# EAGLE design AD7173 (EAGLE 7.4.0)
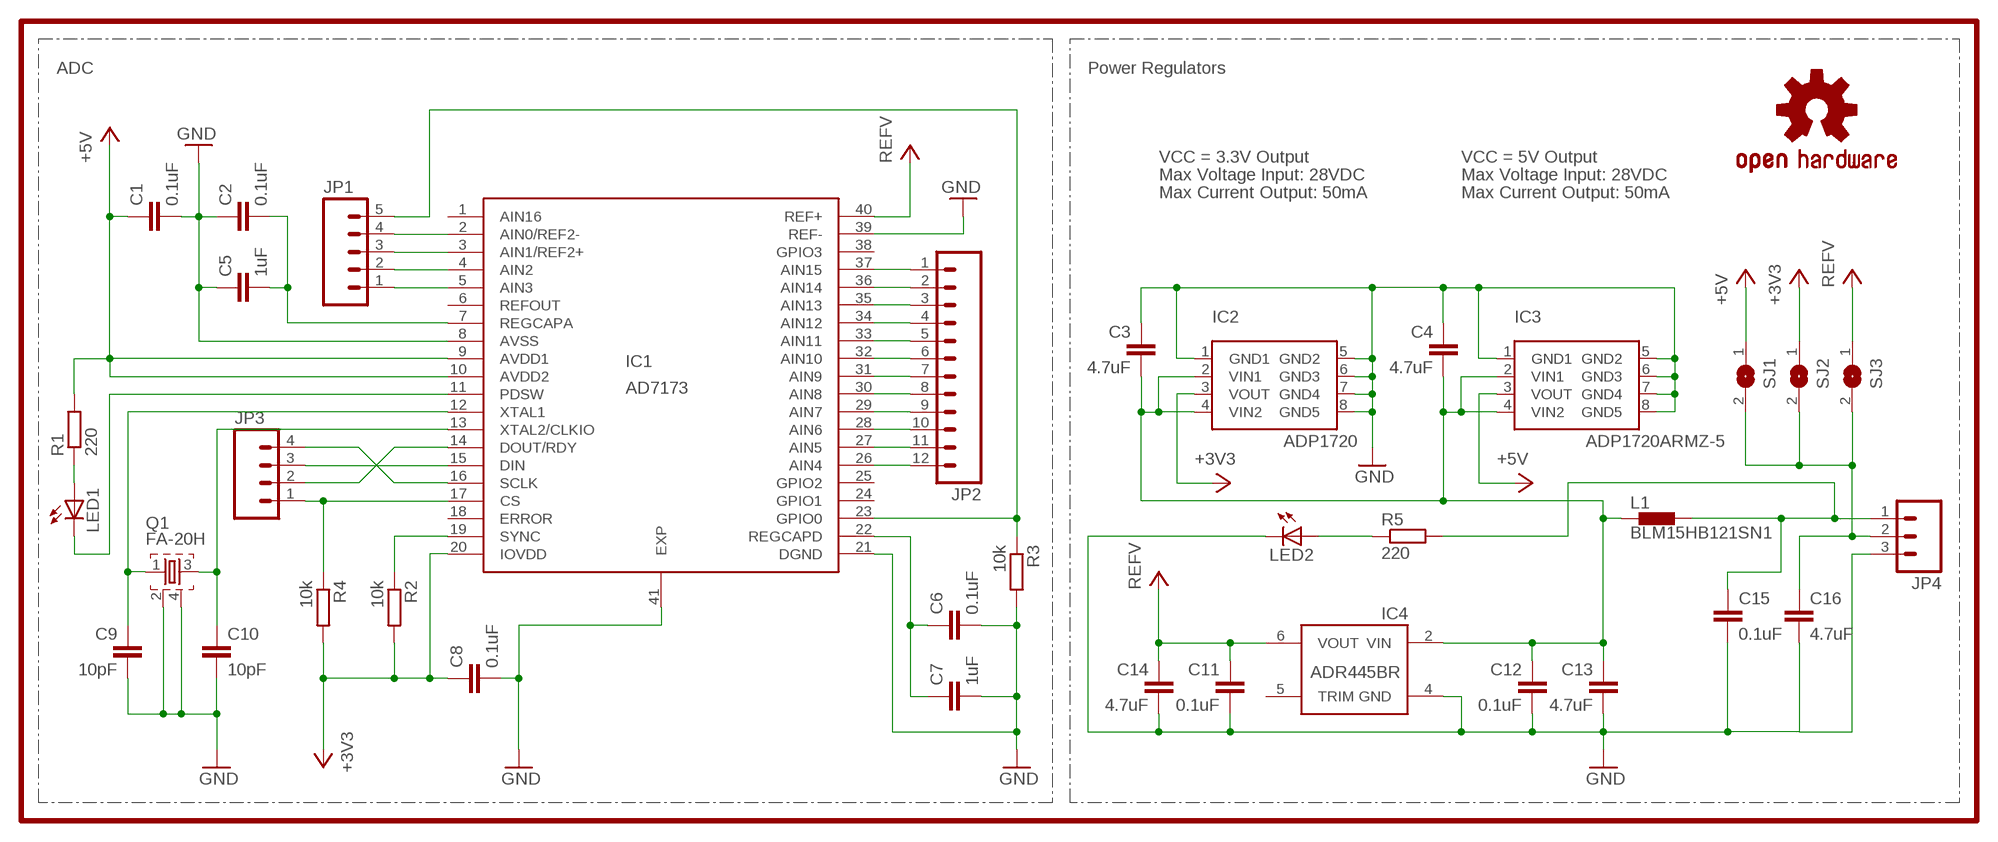
[diagram p0: schematic, sheet 1]

## Parts
C1  0.1uF  C-EUC0402  [C0402]
C2  0.1uF  C-EUC0402  [C0402]
C3  4.7uF  C-EUC0402  [C0402]
C4  4.7uF  C-EUC0402  [C0402]
C5  1uF  C-EUC0402  [C0402]
C6  0.1uF  C-EUC0402  [C0402]
C7  1uF  C-EUC0402  [C0402]
C8  0.1uF  C-EUC0402  [C0402]
C9  10pF  C-EUC0402  [C0402]
C10  10pF  C-EUC0402  [C0402]
C11  0.1uF  C-EUC0402  [C0402]
C12  0.1uF  C-EUC0402  [C0402]
C13  4.7uF  C-EUC0402  [C0402]
C14  4.7uF  C-EUC0402  [C0402]
C15  0.1uF  C-EUC0402  [C0402]
C16  4.7uF  C-EUC0402  [C0402]
IC1  AD7173  [LFCSP_WQ6X6MM]
IC2  ADP1720  POWER  [MSOP08]
IC3  ADP1720ARMZ-5  POWER  [MSOP08]
IC4  ADR445BR  [SO8]
JP1  M05PTH  [1X05]
JP2  M12PTH  [1X12]
JP3  M04PTH  [1X04]
JP4  M03PTH  [1X03]
L1  BLM15HB121SN1  [0402]
LED1  LEDCHIP-LED0603  [CHIP-LED0603]
LED2  LEDCHIP-LED0603  [CHIP-LED0603]
LOGO1  OSHW-LOGOS  [OSHW-LOGO-S]
Q1  FA-20H  [FA-20H]
R1  220  R-EU_R0402  [R0402]
R2  10k  R-EU_R0402  [R0402]
R3  10k  R-EU_R0402  [R0402]
R4  10k  R-EU_R0402  [R0402]
R5  220  R-EU_R0402  [R0402]
SJ1  SJ  [SJ]
SJ2  SJ  [SJ]
SJ3  SJ  [SJ]

## Nets
+3V3: C8.1 IC1.20(IOVDD) IC2.3(VOUT) R2.2 R4.2 SJ2.1
+5V: C1.1 IC1.9(AVDD1) IC1.10(AVDD2) IC3.3(VOUT) R1.2 SJ1.1
GND: C1.2 C2.1 C3.1 C4.1 C5.1 C6.2 C7.2 C8.2 C9.2 C10.2 C11.2 C12.2 C13.2 C14.2 C15.2 C16.2 IC1.8(AVSS) IC1.21(DGND) IC1.39(REF-) IC1.41(EXP) IC2.1(GND1) IC2.5(GND2) IC2.6(GND3) IC2.7(GND4) IC2.8(GND5) IC3.1(GND1) IC3.5(GND2) IC3.6(GND3) IC3.7(GND4) IC3.8(GND5) IC4.4(GND) JP4.3 LED2.C Q1.2 Q1.4 R3.2
N$1: LED1.A R1.1
N$3: IC1.17(CS) JP3.1 R4.1
N$4: IC1.37(AIN15) JP2.1
N$5: IC1.23(GPIO0) JP1.5 R3.1
N$6: C2.2 C5.2 IC1.7(REGCAPA)
N$7: IC1.36(AIN14) JP2.2
N$8: IC1.35(AIN13) JP2.3
N$9: IC1.34(AIN12) JP2.4
N$10: IC1.33(AIN11) JP2.5
N$11: IC1.32(AIN10) JP2.6
N$12: IC1.31(AIN9) JP2.7
N$13: IC1.30(AIN8) JP2.8
N$14: IC1.29(AIN7) JP2.9
N$15: IC1.28(AIN6) JP2.10
N$16: IC1.27(AIN5) JP2.11
N$17: IC1.26(AIN4) JP2.12
N$18: IC1.5(AIN3) JP1.1
N$19: IC1.4(AIN2) JP1.2
N$20: IC1.3(AIN1/REF2+) JP1.3
N$21: IC1.2(AIN0/REF2-) JP1.4
N$22: C10.1 IC1.13(XTAL2/CLKIO) Q1.3
N$23: IC1.14(DOUT/RDY) JP3.2
N$24: IC1.15(DIN) JP3.3
N$25: IC1.16(SCLK) JP3.4
N$27: C9.1 IC1.12(XTAL1) Q1.1
N$28: C16.1 JP4.2 SJ1.2 SJ2.2 SJ3.2
N$30: C15.1 JP4.1 L1.2 R5.2
N$31: LED2.A R5.1
N$38: C6.1 C7.1 IC1.22(REGCAPD)
N$39: IC1.19(SYNC) R2.1
SPI: IC1.11(PDSW) LED1.C
VCC: C11.1 C14.1 IC1.40(REF+) IC4.6(VOUT) SJ3.1 ; supply symbol labelled REFV
VIN: C3.2 C4.2 C12.1 C13.1 IC2.2(VIN1) IC2.4(VIN2) IC3.2(VIN1) IC3.4(VIN2) IC4.2(VIN) L1.1
Unconnected: IC1.1(AIN16) IC1.6(REFOUT) IC1.18(ERROR) IC1.24(GPIO1) IC1.25(GPIO2) IC1.38(GPIO3) IC4.5(TRIM)

## Notes on the sheet
- ADC | Power Regulators
- VCC = 3.3V Output | VCC = 5V Output
- Max Voltage Input: 28VDC | Max Voltage Input: 28VDC
- Max Current Output: 50mA | Max Current Output: 50mA

## Library data of the parts
C1-C16 = rcl:C-EU: CAPACITOR, European symbol
IC1 = AD7173:AD7173: IEEE 802.15.4? 2.4 GHz RF Transceiver Source: http://ww1.microchip.com/downloads/en/DeviceDoc/39776a.pdf; MPN: MRF24J40-I/ML; OC_FARNELL: 1436019; OC_NEWARK: 17M0699
IC2 IC3 = AD7173:POWER
IC4 = kblom:ADR44: Ultralow Noise, LDO XFET Voltage References with Current Sink and Source Applications: Precision data acquisition systems High resolution data converters Battery-powered instrumentation Portable medical instruments Industrial process control systems Precision instruments Optical control circuits source <http://www.analog.com/static/imported-files/data_sheets/ADR440_441_443_444_445.pdf> vref
JP1 = SparkFun-Connectors:M05: Header 5 Standard 5-pin 0.1" header. Use with straight break away headers (SKU : PRT-00116), right angle break away headers (PRT-00553), swiss pins (PRT-00743), machine pins (PRT-00117), and female headers (PRT-00115). Molex polarized connector foot print use with SKU : PRT-08230 with associated crimp pins and housings.
JP2 = SparkFun-Connectors:M12: Header 12 Standard 12-pin 0.1" header. Use with straight break away headers (SKU : PRT-00116), right angle break away headers (PRT-00553), swiss pins (PRT-00743), machine pins (PRT-00117), and female headers (PRT-00115).
JP3 = SparkFun-Connectors:M04: Header 4 Standard 4-pin 0.1" header. Use with straight break away headers (SKU : PRT-00116), right angle break away headers (PRT-00553), swiss pins (PRT-00743), machine pins (PRT-00117), and female headers (PRT-00115). Molex polarized connector foot print use with SKU : PRT-08231 with associated crimp pins and housings. 1MM SMD Version SKU: PRT-10208
JP4 = SparkFun-Connectors:M03: Header 3 Standard 3-pin 0.1" header. Use with straight break away headers (SKU : PRT-00116), right angle break away headers (PRT-00553), swiss pins (PRT-00743), machine pins (PRT-00117), and female headers (PRT-00115). Molex polarized connector foot print use with SKU : PRT-08232 with associated crimp pins and housings.
L1 = inductors:BLM15H: EMIFIL (R) Chip Ferrite Bead for GHz Noise Source: http://www.murata.com/ Ferrite Bead BLM15H.pdf
LED1 LED2 = led:LED: LED OSRAM: - CHIPLED LG R971, LG N971, LY N971, LG Q971, LY Q971, LO R971, LY R971 LH N974, LH R974 LS Q976, LO Q976, LY Q976 LO Q996 - Hyper CHIPLED LW Q18S LB Q993, LB Q99A, LB R99A - SideLED LS A670, LO A670, LY A670, LG A670, LP A670 LB A673, LV A673, LT A673, LW A673 LH A674 LY A675 LS A676, LA A676, LO A676, LY A676, LW A676 LS A679, LY A679, LG A679 - Hyper Micro SIDELED® LS Y876, LA Y876, LO Y876, LY Y876 LT Y87S - SmartLED LW L88C, LW L88S LB L89C, LB L89S, LG L890 LS L89K, LO L89K, LY L89K LS L896, LA L896, LO L896, LY L896 - TOPLED LS T670, LO T670, LY T670, LG T670, LP T670 LSG T670, LSP T670, LSY T670, LOP T670, LYG T670 LG T671, LOG T671, LSG T671 LB T673, LV T673, LT T673, LW T673 LH T674 LS T676, LA T676, LO T676, LY T676, LB T676, LH T676, LSB T676, LW T676 LB T67C, LV T67C, LT T67C, LS T67K, LO T67K, LY T67K, LW E67C LS E67B, LA E67B, LO E67B, LY E67B, LB E67C, LV E67C, LT E67C LW T67C LS T679, LY T679, LG T679 LS T770, LO T770, LY T770, LG T770, LP T770 LB T773, LV T773, LT T773, LW T773 LH T774 LS E675, LA E675, LY E675, LS T675 LS T776, LA T776, LO T776, LY T776, LB T776 LHGB T686 LT T68C, LB T68C - Hyper Mini TOPLED® LB M676 - Mini TOPLED Santana® LG M470 LS M47K, LO M47K, LY M47K Source: http://www.osram.convergy.de LUXEON: - LUMILED® LXK2-PW12-R00, LXK2-PW12-S00, LXK2-PW14-U00, LXK2-PW14-V00 LXK2-PM12-R00, LXK2-PM12-S00, LXK2-PM14-U00 LXK2-PE12-Q00, LXK2-PE12-R00, LXK2-PE12-S00, LXK2-PE14-T00, LXK2-PE14-U00 LXK2-PB12-K00, LXK2-PB12-L00, LXK2-PB12-M00, LXK2-PB14-N00, LXK2-PB14-P00, LXK2-PB14-Q00 LXK2-PR12-L00, LXK2-PR12-M00, LXK2-PR14-Q00, LXK2-PR14-R00 LXK2-PD12-Q00, LXK2-PD12-R00, LXK2-PD12-S00 LXK2-PH12-R00, LXK2-PH12-S00 LXK2-PL12-P00, LXK2-PL12-Q00, LXK2-PL12-R00 Source: www.luxeon.com KINGBRIGHT: KA-3528ASYC Source: www.kingbright.com
LOGO1 = SparkFun-Aesthetics:OSHW-LOGO: Open Source Hardware Logo This logo indicates the piece of hardware it is found on incorporates a OSHW license and/or adheres to the definition of open source hardware found here: http://freedomdefined.org/OSHW
Q1 = crystal:FA-: MHz RANGE CRYSTAL UNIT Source: Epson Toyocom
R1-R5 = rcl:R-EU_: RESISTOR, European symbol
SJ1-SJ3 = jumper:SJ: SMD solder JUMPER

## Net classes
0 default: clearance 0.205 mm

## Board
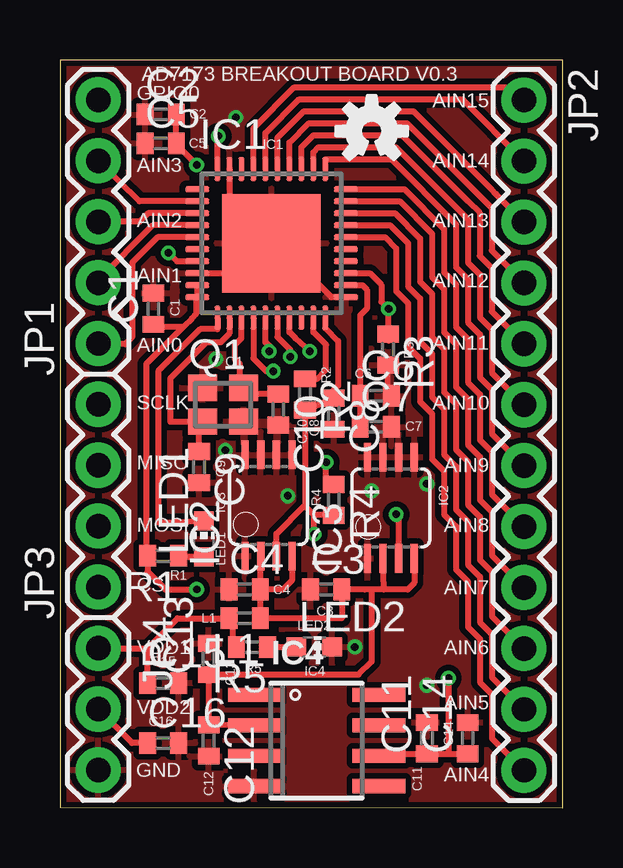
[diagram p1: board, top side]
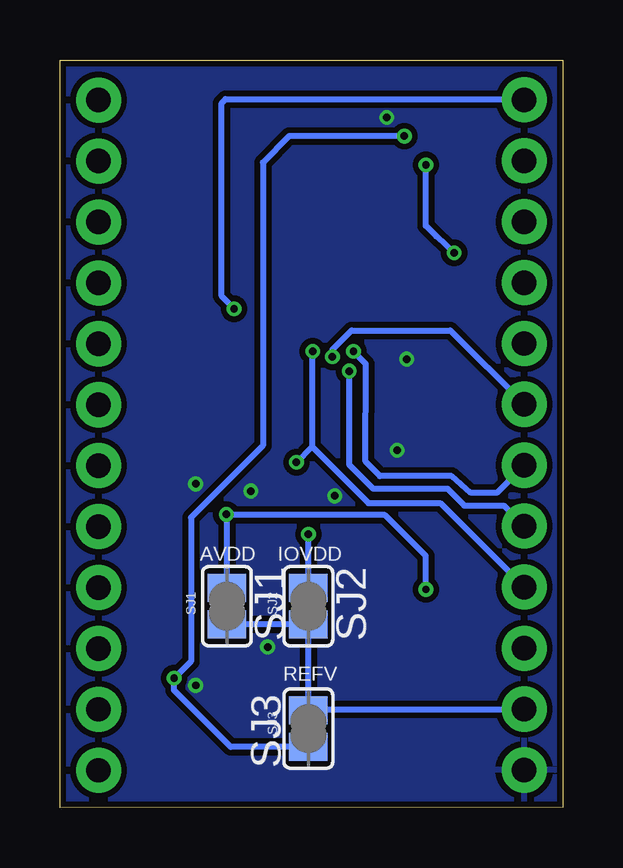
[diagram p2: board, bottom side, seen from below]

Size 20.96 x 31.17 mm. Coordinates in mm from the lower left corner, seen from the top.
Outline: 0,0.01 20.96,0 20.96,31.17 0,31.17 0,0.01
Copper layers (1*16): Top 0.035mm / dielectric 1.5mm / Bottom 0.035mm
Design rules "dirt_cheap_dirty_boards.v1": minimum track width 5mil, minimum drill 12mil, track to track 5mil, track to pad 5mil, pad to pad 5mil, via to via 5mil, smd to smd 0mil, copper to edge 10mil, drill to drill 10mil, minimum pad ring 10mil, minimum via ring 6mil, stop-mask expansion 2mil, vias tented up to drill 25mil, thermal gap 10mil

### Footprints (pad centres in the part's own frame; a part is rotated, then mirrored left to right if it is on the bottom)
C0402 = smd 0.7 x 0.9: 1 -0.65,0; 2 0.65,0
LFCSP_WQ6X6MM = smd 1 x 0.25: 1 -3.1,2.25; 2 -3.1,1.75; 3 -3.1,1.25; 4 -3.1,0.75; 5 -3.1,0.25; 6 -3.1,-0.25; 7 -3.1,-0.75; 8 -3.1,-1.25; 9 -3.1,-1.75; 10 -3.1,-2.25; 21 3.1,-2.25; 22 3.1,-1.75; 23 3.1,-1.25; 24 3.1,-0.75; 25 3.1,-0.25; 26 3.1,0.25; 27 3.1,0.75; 28 3.1,1.25; 29 3.1,1.75; 30 3.1,2.25 | smd 0.25 x 1: 11 -2.25,-3.1; 12 -1.75,-3.1; 13 -1.25,-3.1; 14 -0.75,-3.1; 15 -0.25,-3.1; 16 0.25,-3.1; 17 0.75,-3.1; 18 1.25,-3.1; 19 1.75,-3.1; 20 2.25,-3.1; 31 2.25,3.1; 32 1.75,3.1; 33 1.25,3.1; 34 0.75,3.1; 35 0.25,3.1; 36 -0.25,3.1; 37 -0.75,3.1; 38 -1.25,3.1; 39 -1.75,3.1; 40 -2.25,3.1 | smd 4.1 x 4.1: 41 0,0
MSOP08 = smd 0.3 x 1.2: 1 -0.976,-2.113; 2 -0.326,-2.113; 3 0.324,-2.113; 4 0.974,-2.113; 5 0.974,2.112; 6 0.324,2.112; 7 -0.326,2.112; 8 -0.976,2.112
SO8 = smd 0.6 x 2.2: 1 -1.905,-2.6; 2 -0.635,-2.6; 3 0.635,-2.6; 4 1.905,-2.6; 5 1.905,2.6; 6 0.635,2.6; 7 -0.635,2.6; 8 -1.905,2.6
1X05 = drill 1.016 pad 1.88: 1 0,0; 2 2.54,0; 3 5.08,0; 4 7.62,0; 5 10.16,0
1X12 = drill 1.016 pad 1.88: 1 0,0; 2 2.54,0; 3 5.08,0; 4 7.62,0; 5 10.16,0; 6 12.7,0; 7 15.24,0; 8 17.78,0; 9 20.32,0; 10 22.86,0; 11 25.4,0; 12 27.94,0
1X04 = drill 1.016 pad 1.88: 1 0,0; 2 2.54,0; 3 5.08,0; 4 7.62,0
1X03 = drill 1.016 pad 1.88: 1 0,0; 2 2.54,0; 3 5.08,0
0402 = smd 0.7 x 0.9: 1 -0.65,0; 2 0.65,0
CHIP-LED0603 = smd 0.8 x 0.8: A 0,-0.75; C 0,0.75
FA-20H = smd 1.2 x 1.1: 1 -0.85,-0.7; 2 0.85,-0.7; 3 0.85,0.7; 4 -0.85,0.7
R0402 = smd 0.7 x 0.9: 1 -0.65,0; 2 0.65,0
SJ = smd 1.168 x 1.6: 1 -0.762,0; 2 0.762,0

### Placement (x,y rotation side)
C1  3.9,20.8 90 top
C2  4.2,28.9 0 top
C3  11.1,9.1 0 top
C4  7.7,9.1 0 top
C5  4.2,27.7 0 top
C6  13.17,17.17 0 top
C7  13.17,15.88 0 top
C8  11.42,16.43 270 top
C9  5.8,14.2 270 top
C10  9.1,16.6 270 top
C11  15.3,2.9 90 top
C12  6.2,2.8 270 top
C13  6.2,6.2 90 top
C14  17,2.9 90 top
C15  4.3,5.2 0 top
C16  4.3,2.7 0 top
IC1  8.82,23.53 0 top
IC2  8.7,12.6 0 top
IC3  13.8,12.5 0 top
IC4  10.7,2.8 270 top
JP1  1.6,19.35 90 top
JP2  19.35,29.5 270 top
JP3  1.6,9.2 90 top
JP4  1.6,6.65 270 top
L1  7.7,7.9 180 top
LED1  6,11.2 0 top
LED2  10.6,6.7 270 top
LOGO1  13,28.2 0 top
Q1  6.8,16.8 0 top
R1  4.3,10.5 180 top
R2  10.22,17.23 270 top
R3  13.68,19.1 270 top
R4  11.42,12.83 270 top
R5  8,6.7 180 top
SJ1  14,8.4 270 bottom
SJ2  10.6,8.4 270 bottom
SJ3  10.6,3.3 90 bottom

### Tracks (layer width: path | path; a pad name or v marks a point on that pad's centre or on a via)
+3V3  (via drill 0.31)
  Top 0.254: C8.1 11.47,17.28 | IC1.20 11.07,19.99 11.6,19.46 11.6,17.6 11.42,17.42 C8.1 | 10.2,12.6 10.22,12.62 R2.2 C8.1 | v10.6,11.4 10.6,12.2 | 10.6,12.2 10.2,12.6 | IC2.3 9.02,11.42 10.2,12.6 | R4.2 11.4,12.2 10.6,12.2
  Bottom 0.254: SJ2.1 v10.6,11.4
+5V  (via drill 0.31)
  Top 0.254: IC1.9 IC1.10 5.67,21.28 5.67,20.58 5.5,20.4 5.15,20.05 | 5.15,20.05 3.6,18.5 3.6,10.55 R1.2 3.65,9.85 4.4,9.1 v5.7,9.1 | C1.1 4,20.05 5.15,20.05 | v14.02,12.23 14.12,12.13 IC3.3
  Bottom 0.254: v5.7,9.1 5.7,10.5 7.4,12.2 13.99,12.2 v14.02,12.23 14,12.21 SJ1.1
GND  (via drill 0.31)
  Top 0.254: IC1.8 7.57,22.28 IC1.41 | IC1.39 7.07,25.28 IC1.41 | IC1.21 11.32,21.28 10.67,21.93 10.42,21.93 IC1.41 | C6.2 13.68,17.11 R3.2
  other vias: 7.33,28.78 6.5,18.7 6.9,14.9 13,13.2 12.3,6.7 15.3,13.5 15.3,5.1 9.5,13
  pour Top (isolate 0.24): -0.08,31.15 21.05,31.15 20.94,0.02 -0.19,0.02
  pour Bottom (isolate 0.24): -0.19,31.18 21.04,31.22 21.04,0.06 -0.19,0.02
N$1
  Top 0.254: LED1.A 5.4,10.45 R1.1
N$3  (via drill 0.31)
  Top 0.254: v10.42,19.03 9.82,19.57 9.57,19.82 IC1.17 | R4.1 11.1,13.8 v11.1,14.4
  Bottom 0.254: 10.45,15.05 8.1,12.7 5.1,12.7 JP3.1 | v11.1,14.4 10.45,15.05 | v10.42,19.03 10.45,19 10.45,15.05
N$4
  Top 0.254: IC1.37 8.07,28.33 9.77,30.03 18.82,30.03 JP2.1
N$5  (via drill 0.31)
  Top 0.254: IC1.23 12.92,22.28 13.4,21.8 13.4,21.1 v13.7,20.8 13.7,19.47 R3.1
  Bottom 0.254: JP1.5 1.63,29.54 14.06,29.54 14.22,29.38 14.22,21.32 v13.7,20.8
N$6  (via drill 0.31)
  Top 0.254: v4.52,23.13 4.87,22.78 IC1.7 | v5.7,26.8 4.78,27.72 C5.2 C2.2
  Bottom 0.254: v4.52,23.13 5.27,23.83 5.7,24.26 v5.7,26.8
N$7
  Top 0.254: IC1.36 8.57,28.13 9.97,29.53 16.78,29.53 JP2.2
N$8
  Top 0.254: IC1.35 9.07,27.93 10.17,29.03 14.74,29.03 18,25.77 18.19,25.59 JP2.3
N$9
  Top 0.254: IC1.34 9.57,27.73 10.37,28.53 14.47,28.53 18,25 18,23.23 JP2.4
N$10
  Top 0.254: IC1.33 10.07,27.53 10.57,28.03 14.27,28.03 17.02,25.28 17.5,24.8 17.5,23 18,22.5 18,20.69 JP2.5
N$11
  Top 0.254: IC1.32 10.57,27.33 10.77,27.53 14.02,27.53 17.02,24.53 17.02,22.73 17.52,22.23 17.52,20.43 18.02,19.93 18.02,18.13 JP2.6
N$12
  Top 0.254: IC1.31 11.07,27.03 13.82,27.03 16.52,24.33 16.52,22.53 17.02,22.03 17.02,20.23 17.52,19.73 17.52,17.93 18.02,17.43 18.02,15.59 JP2.7
N$13
  Top 0.254: IC1.30 14.37,25.78 16.02,24.13 16.02,22.33 16.52,21.83 16.52,20.03 17.02,19.53 17.02,17.73 17.52,17.23 17.52,15.33 18.02,14.83 18.02,13.05 JP2.8
N$14
  Top 0.254: IC1.29 14.17,25.28 15.52,23.93 15.52,22.13 16.02,21.63 16.02,19.83 16.52,19.33 16.52,17.53 17.02,17.03 17.02,15.13 17.52,14.63 17.52,12.83 18.02,12.33 18.02,10.51 JP2.9
N$15
  Top 0.254: IC1.28 13.97,24.78 15.02,23.73 15.02,21.93 15.52,21.43 15.52,19.63 16.02,19.13 16.02,17.33 16.52,16.83 16.52,14.93 17.02,14.43 17.02,12.63 17.52,12.13 17.52,10.33 18.02,9.83 18.02,7.97 JP2.10
N$16
  Top 0.254: IC1.27 13.77,24.28 14.52,23.53 14.52,21.73 15.02,21.23 15.02,19.43 15.52,18.93 15.52,17.13 16.02,16.63 16.02,14.73 16.52,14.23 16.52,12.43 17.02,11.93 17.02,10.13 17.52,9.63 17.52,7.73 18.02,7.23 18.02,5.43 JP2.11
N$17
  Top 0.254: IC1.26 13.57,23.78 14.02,23.33 14.02,21.53 14.52,21.03 14.52,19.23 15.02,18.73 15.02,16.93 15.52,16.43 15.52,14.53 16.02,14.03 16.02,12.23 16.52,11.73 16.52,9.93 17.02,9.43 17.02,7.53 17.52,7.03 17.52,5.23 18.02,4.73 18.02,2.89 JP2.12
N$18
  Top 0.254: IC1.5 4.07,23.78 3.02,22.73 3.02,19.63 2.72,19.33 1.59,19.33 JP1.1
N$19
  Top 0.254: IC1.4 3.87,24.28 1.59,22 JP1.2
N$20
  Top 0.254: IC1.3 3.67,24.78 3.32,24.43 JP1.3
N$21
  Top 0.254: IC1.2 3.32,25.28 1.64,26.93 JP1.4
N$22
  Top 0.254: C10.1 7.65,17.25 Q1.3 7.5,17.65 7.5,18.5 7.3,18.7 7.3,19.3 7.57,19.57 IC1.13
N$23  (via drill 0.31)
  Top 0.254: v8.9,18.2 8.6,18.2 8.07,18.73 IC1.14
  Bottom 0.254: v8.9,18.2 8.9,14.3 7.9,13.3 4.8,13.3 4.1,12.6 2.46,12.6 JP3.2
N$24  (via drill 0.31)
  Top 0.254: v8.72,19.03 8.72,19.26 8.57,19.41 IC1.15
  Bottom 0.254: v8.72,19.03 v8.72,19.02 8.2,18.5 8.22,14.43 7.62,13.83 4.62,13.83 3.82,13.13 2.75,13.13 JP3.3
N$25  (via drill 0.31)
  Top 0.254: IC1.16 9.07,19.63 9.6,19.1 v9.6,18.8
  Bottom 0.254: v9.6,18.8 9.6,19.1 8.8,19.9 4.68,19.9 JP3.4
N$27
  Top 0.254: IC1.12 7.07,19.77 6.7,19.4 6.1,19.4 4.6,17.9 4.6,16.1 Q1.1 5.8,16.15 C9.1
N$28
  Top 0.254: C16.1 3,2.7 JP4.2
  Bottom 0.254: SJ1.2 SJ2.2 SJ3.2 10.55,4.11 JP4.2
N$30
  Top 0.254: 3.65,6.65 4.9,7.9 L1.2 7.2,7.7 7.2,6.85 R5.2 | C15.1 3.65,6.65 | JP4.1 3.65,6.65
N$31
  Top 0.254: R5.1 LED2.A
N$38
  Top 0.254: C7.1 C6.1 12.52,20.52 12.8,20.8 12.8,21.6 12.62,21.78 IC1.22
N$39
  Top 0.254: IC1.19 10.57,19.83 11.1,19.3 11.1,18.26 10.72,17.88 R2.1
SPI
  Top 0.254: IC1.11 6.57,19.95 5.85,19.95 4.1,18.2 4.1,11.9 LED1.C
VCC  (via drill 0.31)
  Top 0.254: IC4.6 13.42,2.25 C11.1 16.2,2.25 | IC1.40 6.57,27.97 v6.6,28 | 17.02,2.17 C14.1 16.2,2.25 | v16.2,5.4 16.2,2.25
  Bottom 0.254: 10.6,2.6 SJ3.1 13.84,2.54 16.2,4.9 v16.2,5.4 15.5,6.1 15.5,12.1 12.5,15.1 12.5,26.9 11.4,28 v6.6,28
VIN
  Top 0.254: 13.5,9.1 IC3.2 | 8.35,10.46 IC2.2 | IC2.2 8.4,10.49 | IC2.4 9.67,9.47 9.3,9.1 C4.2 | IC3.4 14.77,9.37 14.5,9.1 13.5,9.1 | 13.5,9.1 13,9.1 | 13,9.1 12.7,9.1 C3.2 11.75,7.9 L1.1 C4.2 | IC4.2 C12.1 C13.1 12.45,5.55 13,6.1 13,9.1 | IC2.2 8.35,10.49 C4.2

### Text on the board
_tsilk: GPIO0 | AD7173 BREAKOUT BOARD V0.3 | AIN15 | C2 | C5 | IC1 | AIN14 | AIN3 | AIN13 | AIN2 | AIN1 | AIN12 | C1 | AIN11 | AIN0 | R3 | Q1 | R2 | C6 | SCLK | AIN10 | C10 | C8 | C7 | AIN9 | MISO | C9 | R4 | IC2 | MOSI | IC3 | AIN8 | R1 | LED1 | AIN7 | CS | C4 | L1 | C3 | LED2 | AIN6 | VDD1 | C15 | R5 | IC4 | C13 | AIN5 | VDD2 | C14 | C16 | AIN4 | GND | C11 | C12
_bsilk: IOVDD | AVDD | SJ2 | SJ1 | REFV | SJ3